# EAGLE schematic cm4 (EAGLE 9.6.2)
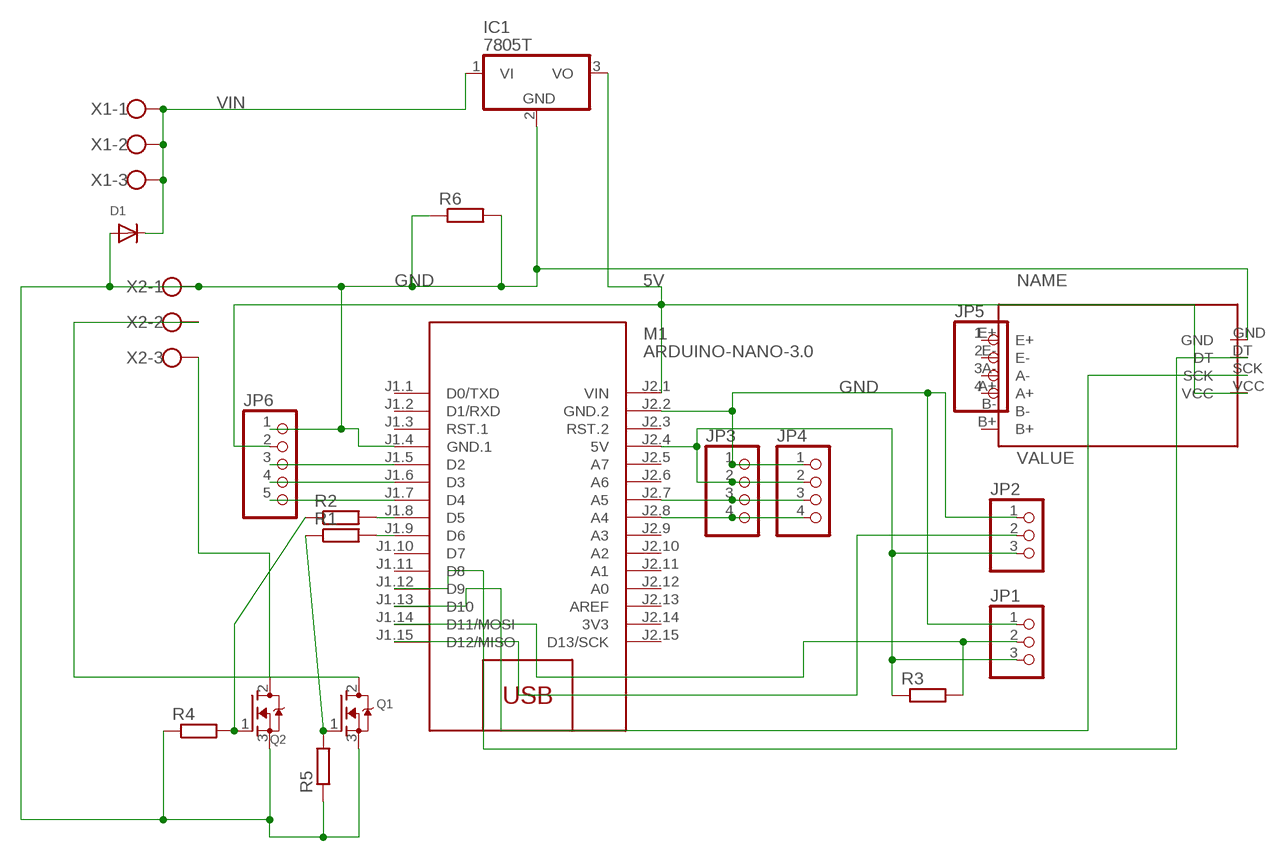
[diagram p0: schematic, sheet 1]

## Parts
D1  DIODEDO-1N4148  [DO-1N4148]
IC1  7805T  [TO220H]
JP1  PINHD-1X3  [1X03]
JP2  PINHD-1X3  [1X03]
JP3  PINHD-1X4  [1X04]
JP4  PINHD-1X4  [1X04]
JP5  PINHD-1X4  [1X04]
JP6  PINHD-1X5  [1X05]
M1  ARDUINO-NANO-3.0  [ARDUINO-NANO-3.0]
Q1  MOSFET-NGDS_TO220V  [TO220V]
Q2  MOSFET-NGDS_TO220V  [TO220V]
R1  R-EU_0207/7  [0207/7]
R2  R-EU_0207/7  [0207/7]
R3  R-EU_0207/7  [0207/7]
R4  R-EU_0207/7  [0207/7]
R5  R-EU_0207/7  [0207/7]
R6  R-EU_0207/7  [0207/7]
U$1  HX711A  [HX711]
X1  W237-103  [W237-103]
X2  W237-103  [W237-103]

## Nets
5V: IC1.3(VO) JP6.2 M1.J2.1(VIN) U$1.VCC
GND: D1.A IC1.2(GND) JP1.1 JP2.1 JP3.1 JP4.1 JP6.1 M1.J1.4(GND.1) M1.J2.2(GND.2) Q1.3(S) Q2.3(S) R4.1 R5.1 R6.1 R6.2 U$1.GND X2.1
N$1: M1.J1.8(D5) R2.2
N$2: M1.J1.9(D6) R1.2
N$3: JP6.3 M1.J1.5(D2)
N$4: JP6.4 M1.J1.6(D3)
N$5: JP5.1 U$1.E+
N$6: JP5.2 U$1.E-
N$7: JP1.3 JP2.3 JP3.2 JP4.2 M1.J2.4(5V) R3.1
N$8: Q1.1(G) R1.1 R5.2
N$9: Q2.1(G) R2.1 R4.2
N$10: Q2.2(D) X2.3
N$11: Q1.2(D) X2.2
N$12: JP6.5 M1.J1.7(D4)
N$13: JP5.3 U$1.A-
N$14: JP5.4 U$1.A+
N$15: M1.J1.12(D9) U$1.DT
N$16: M1.J1.13(D10) U$1.SCK
N$17: JP3.3 JP4.3 M1.J2.7(A5)
N$18: JP3.4 JP4.4 M1.J2.8(A4)
N$20: JP1.2 M1.J1.14(D11/MOSI) R3.2
N$21: JP2.2 M1.J1.15(D12/MISO)
VIN: D1.C IC1.1(VI) X1.1 X1.2 X1.3
Unconnected: M1.J1.1(D0/TXD) M1.J1.2(D1/RXD) M1.J1.3(RST.1) M1.J1.10(D7) M1.J1.11(D8) M1.J2.3(RST.2) M1.J2.5(A7) M1.J2.6(A6) M1.J2.9(A3) M1.J2.10(A2) M1.J2.11(A1) M1.J2.12(A0) M1.J2.13(AREF) M1.J2.15(D13/SCK) U$1.B+ U$1.B-

## Power pins joined to a net without a drawn wire
3V3: M1.J2.14(3V3)

## Library data of the parts
D1 = adafruit:DIODE: Diode SMADIODE - SMA Surface Mount Package 20V 1A Schottky Diode Digikey: 641-1014-6-ND DO-1N4148 - Through Hole Small Current Diode SOD-123 20V 1 A (.5mV Vf) Schottky Diode - Digikey: MBRX120TPMSCT-ND SOD-323 10V 570mA (.38mV Vf, 3ns) Schottky Diode - Digikey: ZLLS410CT-ND SOD-523 30V 30mA Schottky Diode (RB751S-40TE61) - Digikey: RB751S-40TE61CT-ND SOT23-R/W - SOT23 Package (R = Solder Paste/Reflow Ovens, W = Hand-Soldering) BAT54Film 40V 300mA - Digikey: 497-7162-1-ND
IC1 = adafruit:78*: Positive VOLTAGE REGULATOR Added bigger pads to the TO-92 package
JP1 JP2 = adafruit:PINHD-1X3: PIN HEADER
JP3-JP5 = pinhead:PINHD-1X4: PIN HEADER
JP6 = pinhead:PINHD-1X5: PIN HEADER
M1 = diy-modules:ARDUINO-NANO-3.0: Arduino Nano 3.0
Q1 Q2 = adafruit:MOSFET-N: N-Channel Mosfet 2N7002E - 60V 260mA SOT23 [Digikey: 2N7002ET1GOSTR-ND] - REEL BSH103 - 30V 850mA SOT23 [Digikey: 568-5013-1-ND]
R1-R6 = rcl:R-EU_: RESISTOR, European symbol; SPICEPREFIX: R
U$1 = HX711:HX711
X1 X2 = con-wago-500:W237-103: WAGO SCREW CLAMP; MPN: 237-103; OC_FARNELL: unknown; OC_NEWARK: 18M7116